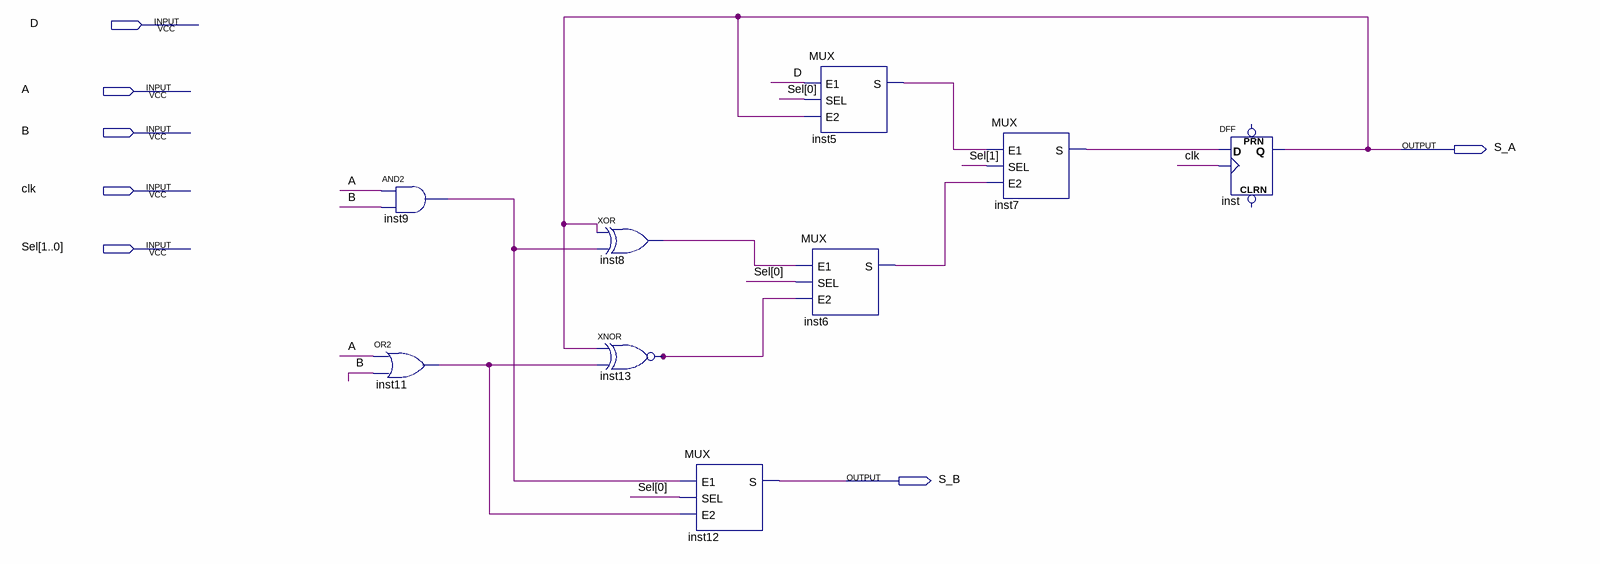
[diagram p0: schematic sheet]
// Quartus schematic Ucontador.bdf as structural Verilog: 9 symbols, 7 pins
module Ucontador (
  input  D,
  input  A,
  input  B,
  input  clk,
  input  [1:0] Sel,
  output S_A,
  output S_B
);

  wire inst5_s, inst6_s, inst7_s, inst8_out, inst9_out, inst11_out, inst13_out;

  and inst9 (inst9_out, A, B);
  or inst11 (inst11_out, A, B);
  xor inst8 (inst8_out, S_A, inst9_out);
  xnor inst13 (inst13_out, S_A, inst11_out);
  MUX inst12 (.E1(inst9_out), .SEL(Sel[0]), .E2(inst11_out), .S(S_B));
  MUX inst5 (.E1(D), .SEL(Sel[0]), .E2(S_A), .S(inst5_s));
  MUX inst6 (.E1(inst8_out), .SEL(Sel[0]), .E2(inst13_out), .S(inst6_s));
  MUX inst7 (.E1(inst5_s), .SEL(Sel[1]), .E2(inst6_s), .S(inst7_s));
  DFF inst (.CLK(clk), .D(inst7_s), .Q(S_A));  // open: CLRN, PRN
endmodule
